# Altium schematic sheet Power_Debug.SchDoc
size A4
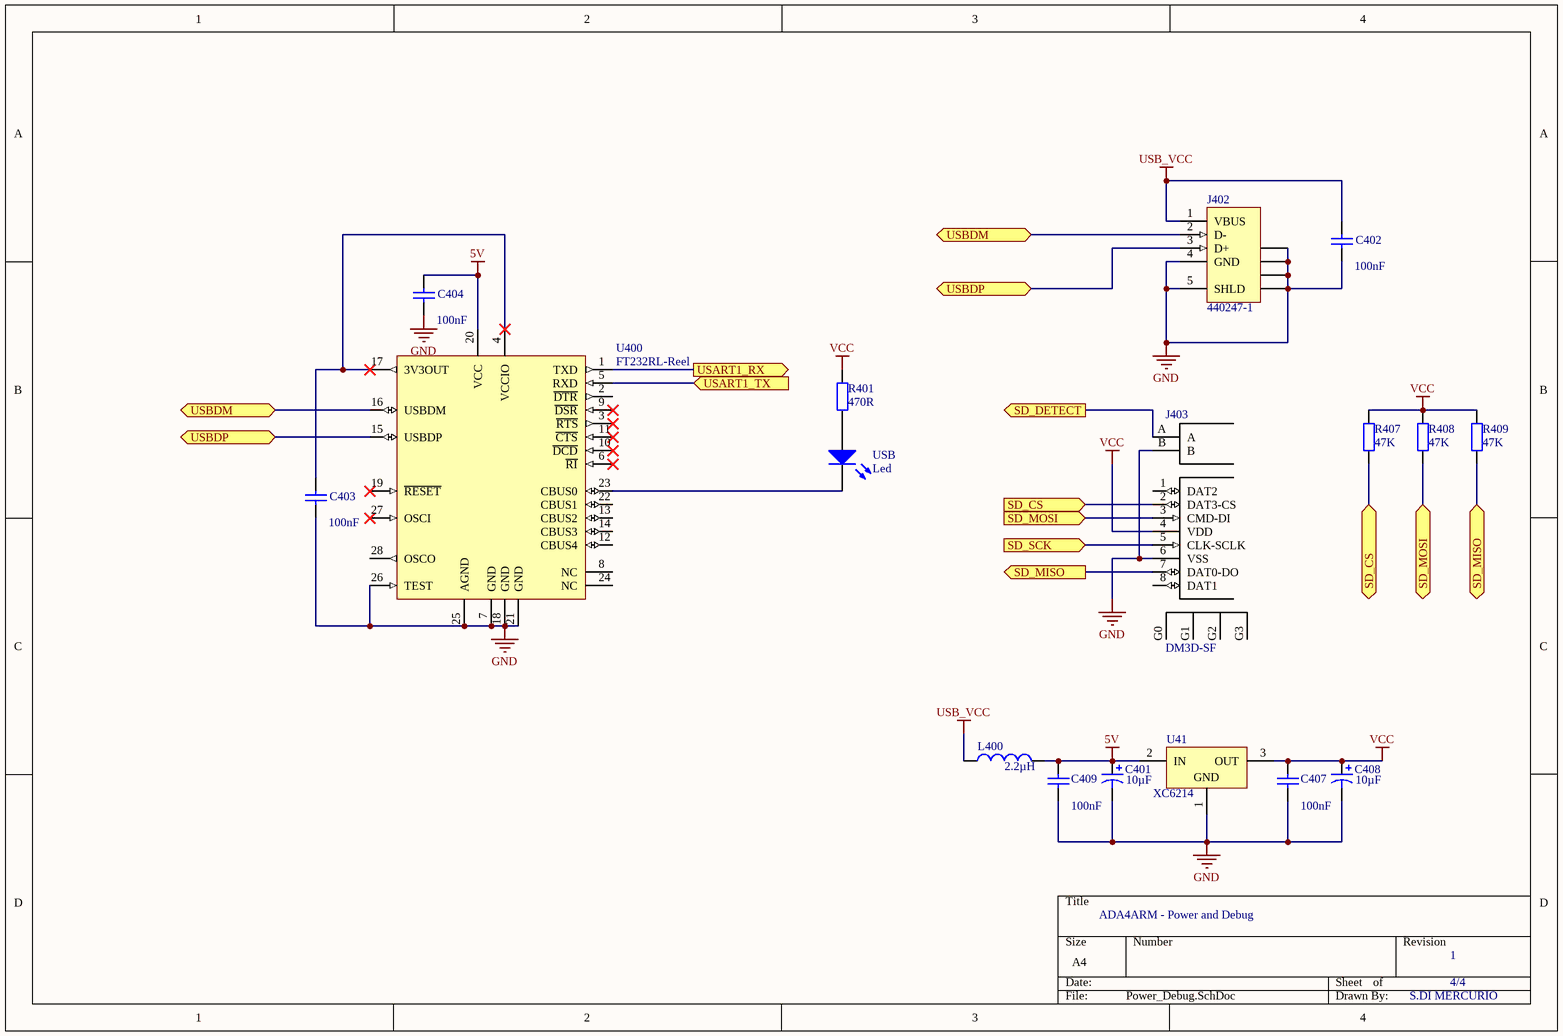
[diagram p0: Power_Debug.SchDoc]

## Parts
C401  value 10µF  [6032]  (hidden comment: Cap Pol3)
C402  value 100nF  [CAPC3216L]  (hidden comment: Cap Semi)
C403  value 100nF  [CAPC3216L]  (hidden comment: Cap Semi)
C404  value 100nF  [CAPC3216L]  (hidden comment: Cap Semi)
C407  value 100nF  [CAPC3216L]  (hidden comment: Cap Semi)
C408  value 10µF  [6032]  (hidden comment: Cap Pol3)
C409  value 100nF  [CAPC3216L]  (hidden comment: Cap Semi)
J402  440247-1  [440247]
J403  DM3D-SF  [DM3D-SF]
L400  value 2.2µH  [NPI43C]  (hidden comment: Inductor)
R401  value 470R  [RESC3216N]  (hidden comment: Res_EU)
R407  value 47K  [RESC3216N]  (hidden comment: 22R)
R408  value 47K  [RESC3216N]  (hidden comment: 22R)
R409  value 47K  [RESC3216N]  (hidden comment: 22R)
U41  XC6214  [SOT-89]
U400  FT232RL-Reel  [SSOP-28_N]
USB  Led  [OSRAM LO Q971]

## Ports
SD_CS, SD_CS (in), SD_DETECT (out), SD_MISO, SD_MISO (out), SD_MOSI, SD_MOSI (in), SD_SCK (in), USART1_RX (out), USART1_TX (in), USBDM (bidir), USBDP (bidir)

## Nets
5V: C401.1 C404.2 C409.2 L400.2 U41.2(IN) U400.20(VCC)
GND: C401.2 C402.1 C403.1 C404.1 C407.1 C408.2 C409.1 J402.4(GND) J402.5(SHLD) J402.6(SHLD) J402.7(SHLD) J402.8(SHLD) J402.9(SHLD) J403.6(VSS) J403.B U41.1(GND) U400.7(GND) U400.18(GND) U400.21(GND) U400.25(AGND) U400.26(TEST)
USB_VCC: C402.2 J402.1(VBUS) L400.1
VCC: C407.2 C408.1 J403.4(VDD) R401.1 R407.1 R408.1 R409.1 U41.3(OUT)
SD_CS: J403.2(DAT3-CS) R407.2 ; port SD_CS
SD_DETECT: J403.A ; port SD_DETECT
SD_MISO: J403.7(DAT0-DO) R409.2 ; port SD_MISO
SD_MOSI: J403.3(CMD-DI) R408.2 ; port SD_MOSI
SD_SCK: J403.5(CLK-SCLK) ; port SD_SCK
USART1_RX: U400.1(TXD) ; port USART1_RX
USART1_TX: U400.5(RXD) ; port USART1_TX
USBDM: J402.2(D-) U400.16(USBDM) ; port USBDM
USBDP: J402.3(D+) U400.15(USBDP) ; port USBDP
NetC403_2: C403.2 U400.4(VCCIO) U400.17(3V3OUT)
NetR401_2: R401.2 USB.A
NetU400_23: U400.23(CBUS0) USB.K

Not connected (* = marked no-connect by the designer): J403 1(DAT2) 8(DAT1) G0(9) G1(10) G2(11) G3(12); U400 2(~{DTR}) 3(~{RTS})* 6(~{RI})* 8(NC) 9(~{DSR})* 10(~{DCD})* 11(~{CTS})* 12(CBUS4) 13(CBUS2) 14(CBUS3) 19(~{RESET})* 22(CBUS1) 24(NC) 27(OSCI)* 28(OSCO)

## Notes on the sheet
- ADA4ARM - Power and Debug
- 1
- 4/4
- S.DI MERCURIO

## Library data of the parts
C401 C408 = Cap Pol3: Polarized Capacitor (Surface Mount); Published: 8-Jun-2000; LatestRevisionDate: 29-May-2009; LatestRevisionNote: IPC-7351 Footprint Added.; PackageReference: C0805; Publisher: Altium Limited; PackageDescription: Chip Capacitor
C402-C404 C407 C409 = Cap Semi: Capacitor (Semiconductor SIM Model); Published: 8-Jun-2000; LatestRevisionDate: 29-May-2009; LatestRevisionNote: IPC-7351 Footprint Added.; PackageReference: C1206; Publisher: Altium Limited; PackageDescription: Chip Capacitor
J402 = 440247-1: USB 2.0, Right Angle, SMT, B Type, Receptacle, 5 Position, Black; ContactMaterial: Copper Alloy; ContactPlating: Gold (30); PCB_Layout: Complies with manufacturer's recommendation.; DrillSize: Corresponds to nominal value.; PanelGround: Without; Published: 15-Jul-2004; DatasheetDocument: 27-Jun-2003; PackageDocument: 27-Jun-2003; PackageReference: 440247; Publisher: Altium Limited; HousingMaterial: Thermoplastic; ComponentLink1Description: Manufacturer Link; ComponentLink1URL: http://www.tycoelectronics.com/; ComponentLink2Description: Packaging Specification; ComponentLink2URL: http://ecommas.tycoelectronics.com/commerce/DocumentDelivery/DDEController?Action=showdoc&DocId=Customer+Drawing%7F440247%7FD%7Fpdf%7FEnglish%7FC_440247_D.pdf
L400 = Inductor: Inductor SMD; Code_IEC: 1005; Published: 8-Jun-2000; LatestRevisionDate: 29-May-2009; LatestRevisionNote: IPC-7351 Footprint Added.; PackageReference: 0402-A; Publisher: Altium Limited; PackageDescription: Chip Inductor; Code_JEITA: 0402
R401 R407-R409 = Res_EU: Resistor; Published: 8-Jun-2000; LatestRevisionDate: 17-Jul-2002; LatestRevisionNote: Re-released for DXP Platform.; PackageReference: AXIAL-0.4; Publisher: Altium Limited
U41 = XC6214: Fixed LDO regulator
U400 = FT232RL-Reel: USB UART Asynchronous Serial Data Transfer Chip, SSOP-28, Tape and Reel; Published: 19-Aug-2010; DatasheetVersion: ver 2.07, Jul-2010; PackageVersion: 2010; PackageReference: SSOP-28; Publisher: Altium Limited; PackageDescription: 28-Pin Small Outline Package 0.65 mm Pitch; ComponentLink1Description: Manufacturer Link; ComponentLink1URL: http://www.ftdichip.com/Products/ICs/FT232R.htm; ComponentLink2Description: Datasheet; ComponentLink2URL: http://www.ftdichip.com/Support/Documents/DataSheets/ICs/DS_FT232R.pdf